# Altium schematic sheet Connector.SchDoc
size 246 x 182 mm
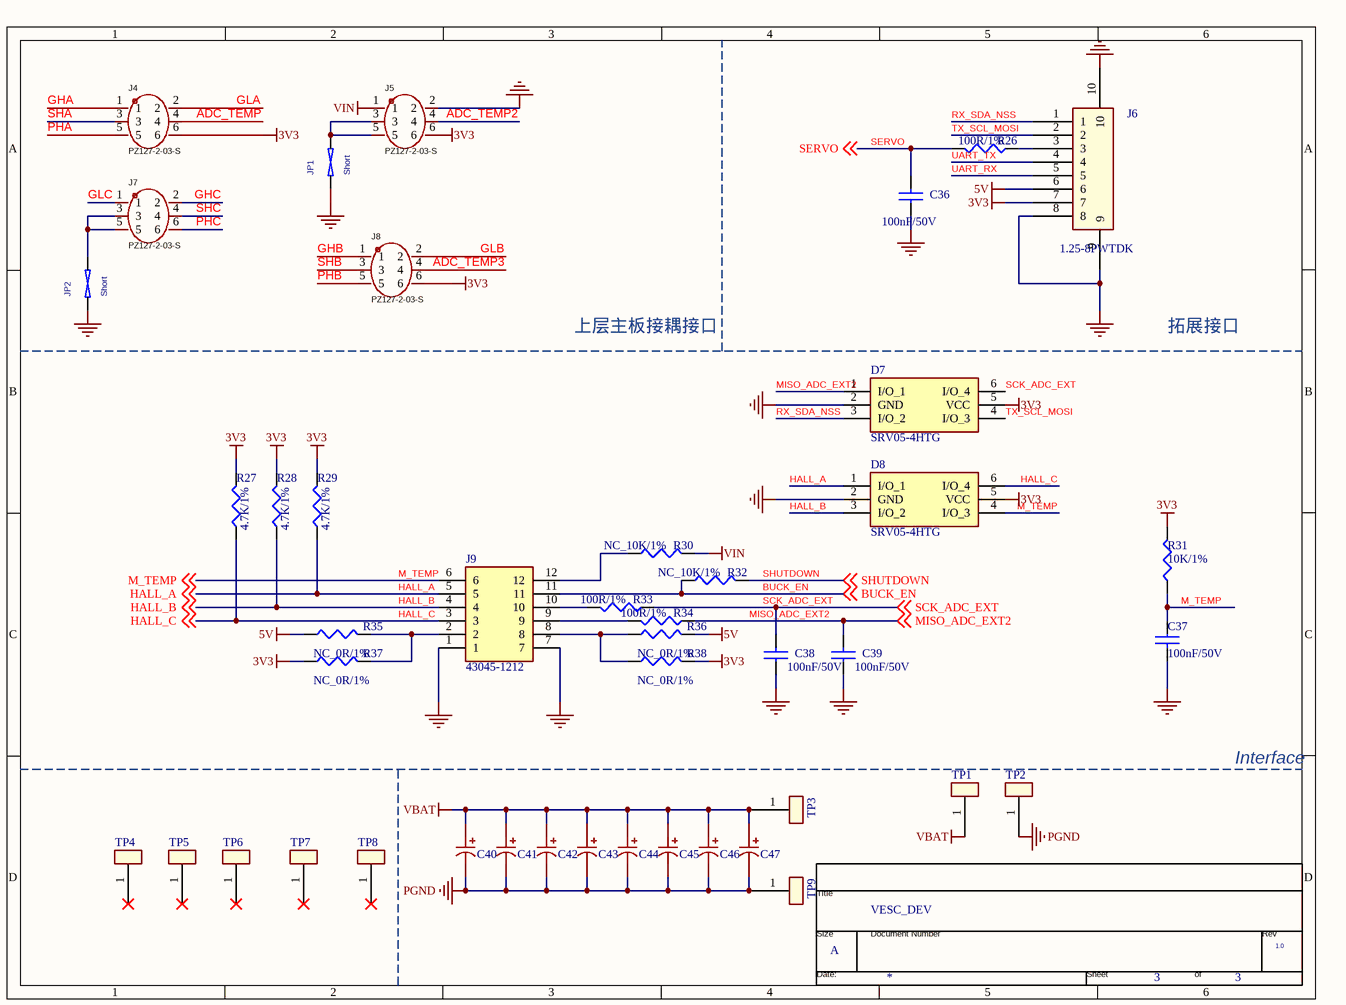
[diagram p0: Connector.SchDoc]

## Parts
*  Page Count: 3  Page Size: A  Title: VESC_DEV  RevCode: 1.0  (hidden comment: TitleBlock0)  (graphical)
C36  100nF/50V  [C0402]
C37  100nF/50V  [C0402]
C38  100nF/50V  [C0402]
C39  100nF/50V  [C0402]
C40  680uF  [CAP-TH_BD10.0-P5.00-D0.6-FD]  (value not drawn)
C41  680uF  [CAP-TH_BD10.0-P5.00-D0.6-FD]  (value not drawn)
C42  680uF  [CAP-TH_BD10.0-P5.00-D0.6-FD]  (value not drawn)
C43  680uF  [CAP-TH_BD10.0-P5.00-D0.6-FD]  (value not drawn)
C44  680uF  [CAP-TH_BD10.0-P5.00-D0.6-FD]  (value not drawn)
C45  680uF  [CAP-TH_BD10.0-P5.00-D0.6-FD]  (value not drawn)
C46  680uF  [CAP-TH_BD10.0-P5.00-D0.6-FD]  (value not drawn)
C47  680uF  [CAP-TH_BD10.0-P5.00-D0.6-FD]  (value not drawn)
D7  SRV05-4HTG  [SOT95P280X145-6N]
D8  SRV05-4HTG  [SOT95P280X145-6N]
J4  PZ127-2-03-S  [HDR-SMD_6P-P1.27-V-M-R2-C3-LS5.3]
J5  PZ127-2-03-S  [HDR-SMD_6P-P1.27-V-M-R2-C3-LS5.3]
J6  1.25-8PWTDK  [SMD-8P-1_25]
J7  PZ127-2-03-S  [HDR-SMD_6P-P1.27-V-M-R2-C3-LS5.3]
J8  PZ127-2-03-S  [HDR-SMD_6P-P1.27-V-M-R2-C3-LS5.3]
J9  43045-1212  [43045-12YY_121314]
JP1  Short  [SHORT]
JP2  Short  [SHORT]
R26  100R/1%  [R0402]
R27  4.7K/1%  [R0402]
R28  4.7K/1%  [R0402]
R29  4.7K/1%  [R0402]
R30  NC_10K/1%  [R0402]
R31  10K/1%  [R0402]
R32  NC_10K/1%  [R0402]
R33  100R/1%  [R0402]
R34  100R/1%  [R0402]
R35  NC_0R/1%  [R0402]
R36  NC_0R/1%  [R0402]
R37  NC_0R/1%  [R0402]
R38  NC_0R/1%  [R0402]
TP1  TEST POINT  [HOLE-4MM_M]  (value not drawn)
TP2  TEST POINT  [HOLE-4MM_M]  (value not drawn)
TP3  TEST POINT  [HOLE-8MM_M]  (value not drawn)
TP4  TEST POINT  [HOLE-4MM_M]  (value not drawn)
TP5  TEST POINT  [HOLE-4MM_M]  (value not drawn)
TP6  TEST POINT  [HOLE-8MM_M]  (value not drawn)
TP7  TEST POINT  [HOLE-8MM_M]  (value not drawn)
TP8  TEST POINT  [HOLE-8MM_M]  (value not drawn)
TP9  TEST POINT  [HOLE-8MM_M]  (value not drawn)

## Nets
3V3: D7.5(VCC) D8.5(VCC) J4.6 J5.6 J6.7 J8.6 R27.2 R28.2 R29.2 R31.2 R37.2 R38.1
5V: J6.6 R35.2 R36.1
GND: C36.1 C37.2 C38.1 C39.1 D7.2(GND) D8.2(GND) J5.2 J6.8 J6.9 J6.10 J9.1 J9.7 JP1.1 JP2.1
PGND: C40.2 C41.2 C42.2 C43.2 C44.2 C45.2 C46.2 C47.2 TP2.1 TP9.1
VBAT: C40.1 C41.1 C42.1 C43.1 C44.1 C45.1 C46.1 C47.1 TP1.1 TP3.1
VIN: J5.1 R30.1
ADC_TEMP: J4.4
ADC_TEMP2: J5.4
ADC_TEMP3: J8.4
BUCK_EN: J9.11 R32.2 ; off-sheet BUCK_EN
GHA: J4.1
GHB: J8.1
GHC: J7.2
GLA: J4.2
GLB: J8.2
GLC: J7.1
HALL_A: D8.1(I/O_1) J9.5 R29.1 ; off-sheet HALL_A
HALL_B: D8.3(I/O_2) J9.4 R28.1 ; off-sheet HALL_B
HALL_C: D8.6(I/O_4) J9.3 R27.1 ; off-sheet HALL_C
M_TEMP: C37.1 D8.4(I/O_3) J9.6 R31.1 ; off-sheet M_TEMP
MISO_ADC_EXT2: C39.2 D7.1(I/O_1) R34.2 ; off-sheet MISO_ADC_EXT2
PHA: J4.5
PHB: J8.5
PHC: J7.6
RX_SDA_NSS: D7.3(I/O_2) J6.1
SCK_ADC_EXT: C38.2 D7.6(I/O_4) R33.2 ; off-sheet SCK_ADC_EXT
SERVO: C36.2 R26.1 ; off-sheet SERVO
SHA: J4.3
SHB: J8.3
SHC: J7.4
SHUTDOWN: R32.1 ; off-sheet SHUTDOWN
TX_SCL_MOSI: D7.4(I/O_3) J6.2
UART_RX: J6.5
UART_TX: J6.4
NetJ5_3: J5.3 J5.5 JP1.2
NetJ6_3: J6.3 R26.2
NetJ7_3: J7.3 J7.5 JP2.2
NetJ9_2: J9.2 R35.1 R37.1
NetJ9_8: J9.8 R36.2 R38.2
NetJ9_9: J9.9 R34.1
NetJ9_10: J9.10 R33.1
NetJ9_12: J9.12 R30.2

Not connected (* = marked no-connect by the designer): TP4 1*; TP5 1*; TP6 1*; TP7 1*; TP8 1*

## Notes on the sheet
- 上层主板接耦接口
- 拓展接口
- Interface
- (in symbol TitleBlock0) Title; Size; Document Number; Rev; Date:; Sheet; of

## Library data of the parts
C36-C39 = CAP NP: PCB Footprint: C0402
C40-C47 = ERS1VM681G16OT: 容值:680uF;精度:±20%;额定电压:35V;纹波电流:-;等效串联电阻:-;; Manufacturer: AISHI(艾华集团); Add into BOM: yes; Tolerance: ±20%; Rated Voltage: 35V; Symbol: ERS1VM681G16OT; Device: ERS1VM681G16OT; LCSC Part Name: 680uF ±20% 35V; Supplier Part: C721283; Manufacturer Part: ERS1VM681G16OT; Supplier Footprint: 插件,D10xL16mm; Datasheet: https://atta.szlcsc.com/upload/public/pdf/source/20191015/C438940_4B8E60A742BB0AE40DDEF87A5C89089D.pdf; Supplier: LCSC; Convert to PCB: yes; Value: 680uF; Ripple Current: -; Equivalent Series Resistance(ESR): -; Lead Spacing: -; φD: -; L: -; Lifetime @ Temp: -
D7 D8 = SRV05-4HTG: TVS Diode (Uni-directional); Manufacturer_Name: LITTELFUSE; Datasheet Link: https://componentsearchengine.com/Datasheets/2/SRV05-4HTG.pdf; Height: 1.45mm; Manufacturer_Part_Number: SRV05-4HTG; Mouser Part Number: 576-SRV05-4HTG; Mouser Price/Stock: https://www.mouser.co.uk/ProductDetail/Littelfuse/SRV05-4HTG?qs=TI15CVqcli3Liexbf3C%2FVA%3D%3D; Arrow Part Number: SRV05-4HTG; Arrow Price/Stock: https://www.arrow.com/en/products/srv05-4htg/littelfuse?region=nac
J4 J5 J7 J8 = PZ127-2-03-S: Manufacturer: HCTL(华灿天禄); Add into BOM: yes; Pin Structure: 2x3P; Pitch: 1.27mm; Circluar Pins/Square Pins: 方针; Current Rating (Max): 1A; Soldering Temperature(Max): 260℃@10S; Symbol: PZ127-2-03-S; Device: PZ127-2-03-S; LCSC Part Name: 2x3P 间距:1.27mm 方针 立贴; Supplier Part: C3975186; Manufacturer Part: PZ127-2-03-S; Supplier Footprint: SMD,P=1.27mm; JLCPCB Part Class: Extended Part; Datasheet: https://atta.szlcsc.com/upload/public/pdf/source/20230609/2ACB07ADC7D4DAF6D292F3D23C037F6C.pdf; Supplier: LCSC; Convert to PCB: yes; Row Spacing: 1.27mm; Mounting Type: 立贴; Number of Rows: 双排; Number of Pins: 6P; Length of Mating Pin: 4mm; Insulation Height: 1.5mm; Length of End Connection Pin: -; Contact Material: 黄铜; Operating Temperature Range: -40℃~+105℃; Color: 黑色
J9 = 43045-1212: Connector; Manufacturer_Name: Molex; Datasheet Link: https://www.molex.com/pdm_docs/sd/430450612_sd.pdf; Height: 9.91mm; Manufacturer_Part_Number: 43045-1212; Mouser Part Number: 538-43045-1212; Mouser Price/Stock: https://www.mouser.co.uk/ProductDetail/Molex/43045-1212?qs=359VwiUTsp27ERpkj8aHfQ%3D%3D
JP1 JP2 = SHORT: 2 PIN SHORTED TO CONNECT DIFFERENT NETS; PART_NUMBER: TMP-442; CLASS: DISCRETE
R26-R38 = RESISTOR: PCB Footprint: R0402
* = TitleBlock0: Page Number: 3; Page Create Date: March  8, 1995; Page Modify Date: *